# Altium schematic sheet 2_ADC.SCHDOC
size 297 x 209 mm; SheetNumber: 7; SheetTotal: 18; DocumentName: 2_ADC.SCHDOC
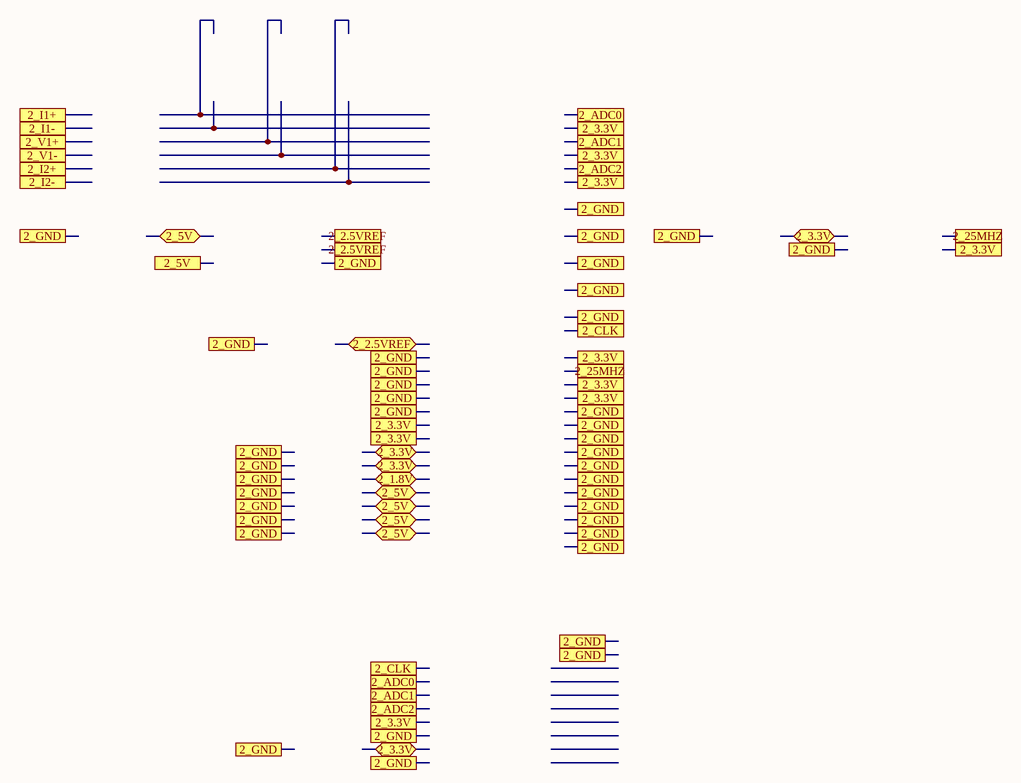
[diagram p0: 2_ADC.SCHDOC]

## Ports
2_1.8V (bidir), 2_2.5VREF, 2_2.5VREF (bidir), 2_3.3V, 2_3.3V (bidir), 2_5V, 2_5V (bidir), 2_25MHZ, 2_ADC0, 2_ADC1, 2_ADC2, 2_CLK, 2_GND, 2_I1+, 2_I1-, 2_I2+, 2_I2-, 2_V1+, 2_V1-

## Notes on the sheet
- A
- B
- C
- D
- 1
- 2
- 3
- Title
- 4
- Size
- A4
- Number
- Rev
- Date
- Filename
- Drawn by
- Sheet
- of